# Altium schematic sheet Bypass.SchDoc
size A
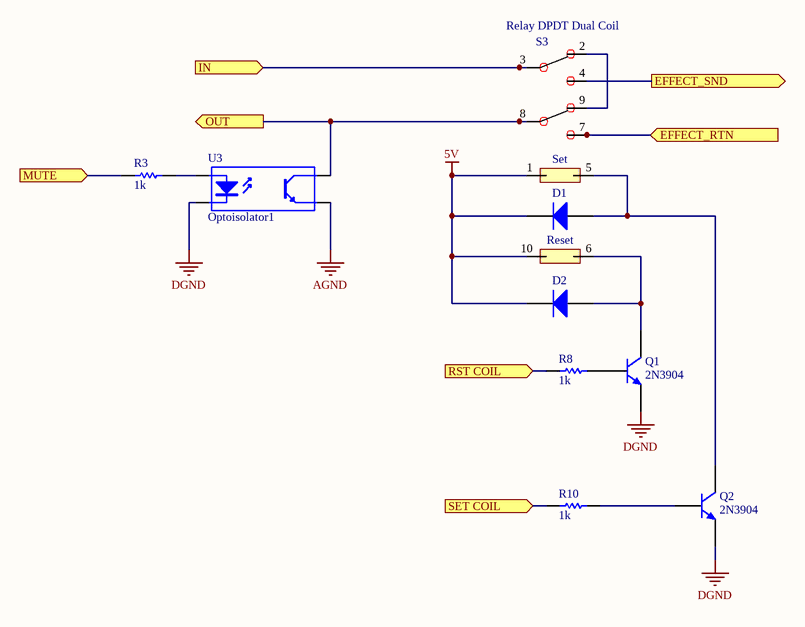
[diagram p0: Bypass.SchDoc]

## Parts
D1  Diode 1N4148  [DO-35]  (value not drawn)
D2  Diode 1N4148  [DO-35]  (value not drawn)
Q1  2N3904  [TO-92A]
Q2  2N3904  [TO-92A]
R3  1k  [ERA-0805]
R8  1k  [ERA-0805]
R10  1k  [ERA-0805]
S3  Relay DPDT Dual Coil  [EB2 Relay]
U3  Optoisolator1  [DIP-4]

## Ports
EFFECT_RTN (in), EFFECT_SND (out), IN (in), MUTE (in), OUT (out), RST COIL (in), SET COIL (in)

## Nets
5V: D1.2(K) D2.2(K) S3.1 S3.10
AGND: U3.3(E)
DGND: Q1.1(E) Q2.1(E) U3.2(K)
EFFECT_RTN: S3.7 ; port EFFECT_RTN
EFFECT_SND: S3.4 ; port EFFECT_SND
IN: S3.3 ; port IN
MUTE: R3.2 ; port MUTE
OUT: S3.8 U3.4(C) ; port OUT
RST COIL: R8.2 ; port RST COIL
SET COIL: R10.2 ; port SET COIL
NetD1_1: D1.1(A) Q2.3(C) S3.5
NetD2_1: D2.1(A) Q1.3(C) S3.6
NetQ1_2: Q1.2(B) R8.1
NetQ2_2: Q2.2(B) R10.1
NetR3_1: R3.1 U3.1(A)
NetS3_2: S3.2 S3.9

## Notes on the sheet
- (in symbol Relay DPDT Dual Coil) Set; Reset

## Library data of the parts
D1 D2 = Diode 1N4148: High Conductance Fast Diode; Published: 8-Jun-2000; LatestRevisionDate: 17-Jul-2002; LatestRevisionNote: Re-released for DXP Platform.; DatasheetVersion: 1997; PackageReference: DO-35; Publisher: Altium Limited; PackageDescription: Diode, Axial; Body 3.8 x 1.9 mm (LxDia. max), Lead Dia. 0.53 mm (max); Code_JEDEC: DO-204-AH; ComponentLink1Description: Manufacturer Link; ComponentLink1URL: http://www.fairchildsemi.com/; ComponentLink2Description: Datasheet; ComponentLink2URL: http://www.fairchildsemi.com/ds/1N%2F1N4148.pdf
Q1 Q2 = 2N3904: NPN General Purpose Amplifier; Published: 8-Jun-2000; LatestRevisionDate: 15-Jan-2003; LatestRevisionNote: PCB Footprint 'BCY-W3/D4.7' replaced; DatasheetVersion: 1997; PackageVersion: Sep-1998; PackageReference: TO-92A; Publisher: Altium Limited; PackageDescription: TO, Flat Index; 3 In-Line, Axial Leads; Body Dia. 4.5mm; Leads 0.51 x 0.48 mm (max); ComponentLink1Description: Manufacturer Link; ComponentLink1URL: http://www.fairchildsemi.com/; ComponentLink2Description: Datasheet; ComponentLink2URL: http://www.fairchildsemi.com/ds/2N%2F2N3904.pdf
R3 R8 R10 = ERAS: Metal Film Thermosensitive Chip Resistor, 0.56 Ohm to 10k Ohm Range, 5% Tolerance, 0805 Size, 0.1 W; Note: If flow soldering, adjust pad width of PCB Footprint to 0.7 - 0.8 times the width of the resistor.; Published: 17-Dec-2003; LatestRevisionDate: 19-Mar-2004; LatestRevisionNote: Silkscreen size reduced.; PackageDocument: Mar-2003; PackageReference: ERA-0805; Publisher: Altium Limited; Code_IPC: 2012 [0805]; ComponentLink1Description: Manufacturer Link; ComponentLink1URL: http://www.panasonic.com/industrial/components/resistive_products.htm; ComponentLink2Description: Datasheet; ComponentLink2URL: http://www.panasonic.com/industrial/components/pdf/AOF0000CE1.pdf
U3 = Optoisolator1: 4-Pin Phototransistor Optocoupler; Published: 24-Mar-1999; LatestRevisionDate: 04-Mar-2005; LatestRevisionNote: Sch pins 3 & 4 Swapped.; DatasheetVersion: Nov-2003; PackageReference: DIP-4; Publisher: Altium Limited